# Altium schematic sheet ADC-DAC Converter.SchDoc: STM32 ADC-DAC Converter
size A4; Author: Atakana; Engineer: Atakan Ağcakaya; Revision: V1; SheetNumber: 1; SheetTotal: 1
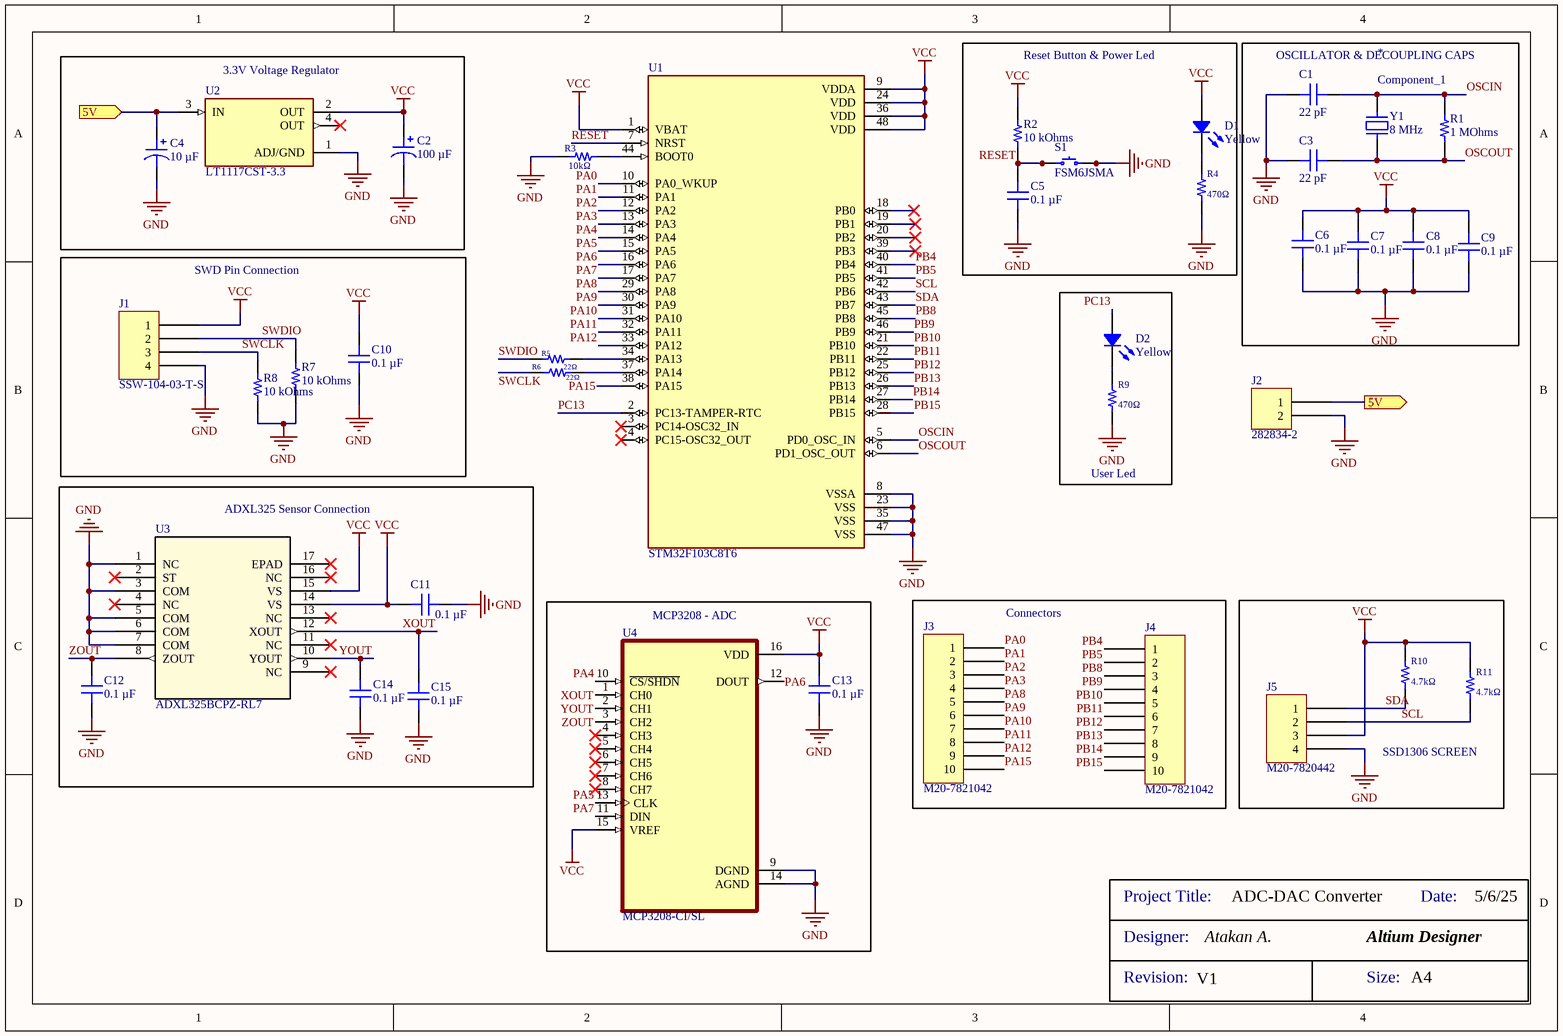
[diagram p0: ADC-DAC Converter.SchDoc]

## Parts
(Parts that share a designator on the sheet are numbered #1, #2 ... from top to bottom, then left to right.)
*#1  Component_1
*#2  DateProject: 5/6/25  ProjectTitle: ADC-DAC Converter  RevisionProject: V1  Size: A4  Designer: Atakan A.  (hidden comment: Title Block)  (graphical)
C1  22 pF  [CAP 0805_2012]
C2  value 100 µF  [CAP POL 1411_3528]  (hidden comment: 100uF)
C3  22 pF  [CAP 0805_2012]
C4  10 µF  [CAP POL 1411_3528]
C5  0.1 µF  [CAP 1206_3216 - 0.8MM]
C6  0.1 µF  [CAP 1206_3216 - 0.8MM]
C7  0.1 µF  [CAP 1206_3216 - 0.8MM]
C8  0.1 µF  [CAP 1206_3216 - 0.8MM]
C9  0.1 µF  [CAP 1206_3216 - 0.8MM]
C10  0.1 µF  [CAP 1206_3216 - 0.8MM]
C11  0.1 µF  [CAP 0805_2012]
C12  0.1 µF  [CAP 0805_2012]
C13  0.1 µF  [CAP 0805_2012]
C14  0.1 µF  [CAP 0805_2012]
C15  0.1 µF  [CAP 0805_2012]
D1  Yellow  [LED 1206_3216 YELLOW]
D2  Yellow  [LED 1206_3216 YELLOW]
J1  SSW-104-03-T-S  [SAMTEC SSW-104-03-T-S]
J2  282834-2  [TE 282834-2]
J3  M20-7821042  [HARWIN M20-7821045]
J4  M20-7821042  [HARWIN M20-7821045]
J5  M20-7820442  [HARWIN M20-7820445]
R1  1 MOhms  [RES 0805_2012]
R2  10 kOhms  [RES 1206_3216]
R3  10kΩ  [RES 0805_2012]
R4  470Ω  [RES 0805_2012]
R5  22Ω  [RES 0805_2012]
R6  22Ω  [RES 0805_2012]
R7  10 kOhms  [RES 1206_3216]
R8  10 kOhms  [RES 1206_3216]
R9  470Ω  [RES 0805_2012]
R10  4.7kΩ  [RES 0805_2012]
R11  4.7kΩ  [RES 0805_2012]
S1  FSM6JSMA  [TE FSM6JSMA]
U1  STM32F103C8T6  [QFP50P900X900X160-48N]
U2  LT1117CST-3.3  [REG_LT1117CST-3.3]
U3  ADXL325BCPZ-RL7  [CP_16_5A_ADI-M]
U4  MCP3208-CI/SL  [SOIC127P600X175-16N]
Y1  8 MHz  [ABRACON ABLS]

## Blocks framed on the sheet
3.3V Voltage Regulator: C2 C4 U2
Reset Button & Power Led: C5 D1 R2 R4 S1
OSCILLATOR & DECOUPLING CAPS: *#1 C1 C3 C6-C9 R1 Y1
SWD Pin Connection: C10 J1 R7 R8
User Led: D2 R9
ADXL325 Sensor Connection: C11 C12 C14 C15 U3
MCP3208 - ADC: C13 U4
Connectors: J3 J4
SSD1306 SCREEN: J5 R10 R11

## Ports
5V (in), 5V (out)

## Nets
GND: C1.1 C2.2 C3.1 C4.2 C5.1 C6.1 C7.1 C8.1 C9.1 C10.1 C11.1 C12.1 C13.1 C14.1 C15.1 J1.4 J2.2 J5.4 R3.1 R4.2 R7.1 R8.1 R9.2 S1.3 S1.4 U1.8(VSSA) U1.23(VSS) U1.35(VSS) U1.47(VSS) U2.1(ADJ/GND) U3.1(NC) U3.3(COM) U3.5(COM) U3.6(COM) U3.7(COM) U4.9(DGND) U4.14(AGND)
VCC: C2.1 C6.2 C7.2 C8.2 C9.2 C10.2 C11.2 C13.2 D1.1 J1.1 J5.3 R2.2 R10.1 R11.1 U1.1(VBAT) U1.9(VDDA) U1.24(VDD) U1.36(VDD) U1.48(VDD) U2.2(OUT) U3.14(VS) U3.15(VS) U4.15(VREF) U4.16(VDD)
5V: C4.1 J2.1 U2.3(IN) ; port 5V
OSCIN: C1.2 R1.2 U1.5(PD0_OSC_IN) Y1.2
OSCOUT: C3.2 R1.1 U1.6(PD1_OSC_OUT) Y1.1
PA0: J3.1 U1.10(PA0_WKUP)
PA1: J3.2 U1.11(PA1)
PA2: J3.3 U1.12(PA2)
PA3: J3.4 U1.13(PA3)
PA4: U1.14(PA4) U4.10(~{CS/SHDN})
PA5: U1.15(PA5) U4.13(CLK)
PA6: U1.16(PA6) U4.12(DOUT)
PA7: U1.17(PA7) U4.11(DIN)
PA8: J3.5 U1.29(PA8)
PA9: J3.6 U1.30(PA9)
PA10: J3.7 U1.31(PA10)
PA11: J3.8 U1.32(PA11)
PA12: J3.9 U1.33(PA12)
PA15: J3.10 U1.38(PA15)
PB4: J4.1 U1.40(PB4)
PB5: J4.2 U1.41(PB5)
PB8: J4.3 U1.45(PB8)
PB9: J4.4 U1.46(PB9)
PB10: J4.5 U1.21(PB10)
PB11: J4.6 U1.22(PB11)
PB12: J4.7 U1.25(PB12)
PB13: J4.8 U1.26(PB13)
PB14: J4.9 U1.27(PB14)
PB15: J4.10 U1.28(PB15)
PC13: D2.1 U1.2(PC13-TAMPER-RTC)
RESET: C5.2 R2.1 S1.1 S1.2 U1.7(NRST)
SCL: J5.2 R11.2 U1.42(PB6)
SDA: J5.1 R10.2 U1.43(PB7)
SWCLK: J1.3 R6.2 R8.2
SWDIO: J1.2 R5.2 R7.2
XOUT: C15.2 U3.12(XOUT) U4.1(CH0)
YOUT: C14.2 U3.10(YOUT) U4.2(CH1)
ZOUT: C12.2 U3.8(ZOUT) U4.3(CH2)
NetD1_2: D1.2 R4.1
NetD2_2: D2.2 R9.1
NetR3_2: R3.2 U1.44(BOOT0)
NetR5_1: R5.1 U1.34(PA13)
NetR6_1: R6.1 U1.37(PA14)

Not connected (* = marked no-connect by the designer): U1 3(PC14-OSC32_IN)* 4(PC15-OSC32_OUT)* 18(PB0)* 19(PB1)* 20(PB2)* 39(PB3)*; U2 4(OUT)*; U3 2(ST)* 4(NC)* 9(NC)* 11(NC)* 13(NC)* 16(NC)* 17(EPAD)*; U4 4(CH3)* 5(CH4)* 6(CH5)* 7(CH6)* 8(CH7)*

## Notes on the sheet
- Title
- Size:
- Date:
- A4
- Number:
- Time:
- Revision:
- Sheet
- of
- File:
- (in symbol Title Block) Project Title:; Date:; Designer:; Altium Designer; Revision:; Size:

## Library data of the parts
C1 C3 = 885012007030: CAP CER 22PF 25V C0G/NP0 0805; manufacturer: Würth Elektronik; Temperature Coefficient: C0G, NP0; Tolerance: ±5%; Part Number: 885012007030; Applications: General Purpose; componentlink1description: Datasheet; componentlink1url: https://katalog.we-online.de/pbs/datasheet/885012007030.pdf; componentlink2description: DigiKey Link; componentlink2url: https://www.digikey.com/en/products/detail/würth-elektronik/885012007030/5453684; Device Package: 0805 (2012 Metric); lastupdated: 9.02.2024 20:15:45; Lifecycle Status: Active; Minimum Order: 1; Mounting Type: Surface Mount, MLCC; Operating Temperature: -55°C ~ 125°C; Package / Case: 0805 (2012 Metric); packaging: TapeAndReel; partid: 11788; Part Status: Active; price: 0.03; series: WCAP-CSGP; Size / Dimension: 0.079" L x 0.049" W (2.00mm x 1.25mm); Supplier 1: DigiKey; Supplier Part Number 1: 732-7829-1-ND; Thickness (Max): 0.028" (0.70mm); value: 22 pF; Voltage - Rated: 25V
  C1: Capacitance: 22 pF
C2 = T491T106K016AT: CAP TANT 100UF 10% 16V 1411; manufacturer: KEMET; Manufacturer Size Code: T; ESR (Equivalent Series Resistance): 8Ohm; Lifetime @ Temp.: 2000 Hrs @ 125°C; Type: Molded; Part Number: T491T106K016AT; Capacitance: 100 uF; componentlink1description: Datasheet; componentlink1url: https://api.kemet.com/component-edge/download/datasheet/T491T106K016AT.pdf; componentlink2description: DigiKey Link; componentlink2url: https://www.digikey.com/en/products/detail/kemet/T491T106K016AT/2336362; Device Package: 1411 (3528 Metric); Features: General Purpose; Height - Seated (Max): 0.047" (1.20mm); lastupdated: 3.06.2024 19:29:03; Lifecycle Status: Active; Minimum Order: 1; Mounting Type: Surface Mount; Operating Temperature: -55°C ~ 125°C; Package / Case: 1411 (3528 Metric); packaging: TapeAndReel; partid: 5; Part Status: Active; price: 0.42; series: T491; Size / Dimension: 0.138" L x 0.110" W (3.50mm x 2.80mm); Supplier 1: DigiKey; Supplier Part Number 1: 399-8400-1-ND; Tolerance: ±10%; Voltage - Rated: 16 V
C4 = T491T106K016AT: CAP TANT 10UF 10% 16V 1411; manufacturer: KEMET; Manufacturer Size Code: T; ESR (Equivalent Series Resistance): 8Ohm; Lifetime @ Temp.: 2000 Hrs @ 125°C; Type: Molded; Part Number: T491T106K016AT; Value: 10 µF; Capacitance: 10 µF; componentlink1description: Datasheet; componentlink1url: https://api.kemet.com/component-edge/download/datasheet/T491T106K016AT.pdf; componentlink2description: DigiKey Link; componentlink2url: https://www.digikey.com/en/products/detail/kemet/T491T106K016AT/2336362; Device Package: 1411 (3528 Metric); Features: General Purpose; Height - Seated (Max): 0.047" (1.20mm); lastupdated: 3.06.2024 19:29:03; Lifecycle Status: Active; Minimum Order: 1; Mounting Type: Surface Mount; Operating Temperature: -55°C ~ 125°C; Package / Case: 1411 (3528 Metric); packaging: TapeAndReel; partid: 5; Part Status: Active; price: 0.42; series: T491; Size / Dimension: 0.138" L x 0.110" W (3.50mm x 2.80mm); Supplier 1: DigiKey; Supplier Part Number 1: 399-8400-1-ND; Tolerance: ±10%; Voltage - Rated: 16 V
C5-C10 = C1206C104K8RAC7800: CAP CER 0.1UF 10V X7R 1206; manufacturer: KEMET; Tolerance: ±10%; Part Number: C1206C104K8RAC7800; Applications: Bypass, Decoupling; componentlink1description: Datasheet; componentlink1url: https://api.kemet.com/component-edge/download/datasheet/C1206C104K8RACTU.pdf; componentlink2description: DigiKey Link; componentlink2url: https://www.digikey.com/en/products/detail/kemet/C1206C104K8RAC7800/2215080; Device Package: 1206 (3216 Metric); lastupdated: 4.06.2024 19:10:37; Lifecycle Status: Active; Minimum Order: 1; Mounting Type: Surface Mount, MLCC; Operating Temperature: -55°C ~ 125°C; Package / Case: 1206 (3216 Metric); packaging: TapeAndReel; partid: 19429; Part Status: Active; price: 0.07; series: SMD Comm X7R; Size / Dimension: 0.126" L x 0.063" W (3.20mm x 1.60mm); Supplier 1: DigiKey; Supplier Part Number 1: 399-15539-1-ND; Temperature Coefficient: X7R; Thickness (Max): 0.035" (0.88mm); value: 0.1 µF; Voltage - Rated: 10V
C11-C15 = 0805Y0250104KXT: CAP CER 0.1UF 25V X7R 0805; manufacturer: Knowles Syfer; Tolerance: ±10%; Part Number: 0805Y0250104KXT; Capacitance: 0.1 µF; Applications: Boardflex Sensitive; componentlink1description: Datasheet; componentlink1url: https://www.knowlescapacitors.com/getattachment/2dbfc8bc-e2b3-4b4d-afb1-43b011b9ebe0/High-Std-Voltage.aspx; componentlink2description: DigiKey Link; componentlink2url: https://www.digikey.com/en/products/detail/knowles-syfer/0805Y0250104KXT/5729991; Device Package: 0805 (2012 Metric); Features: Soft Termination; lastupdated: 9.02.2024 20:16:06; Lifecycle Status: Active; Minimum Order: 1; Mounting Type: Surface Mount, MLCC; Operating Temperature: -55°C ~ 125°C; Package / Case: 0805 (2012 Metric); packaging: TapeAndReel; partid: 3471; Part Status: Active; price: 0.15; series: FlexiCap™; Size / Dimension: 0.079" L x 0.049" W (2.00mm x 1.25mm); Supplier 1: DigiKey; Supplier Part Number 1: 1608-1010-1-ND; Temperature Coefficient: X7R; Thickness (Max): 0.051" (1.30mm); value: 0.1 µF; Voltage - Rated: 25V
D1 D2 = 5990240007F: LED YELLOW 1206 SMD; Manufacturer: Dialight; Configuration: Standard; Current - Test: 20mA; Lens Color: 0.80mm; Lens Size: 2.00mm x 1.60mm; Lens Style: Rectangle with Flat Top; Millicandela Rating: 126mcd; Viewing Angle: 140°; Voltage - Forward (Vf) (Typ): 2.1V; Wavelength - Dominant: 590nm; Part Number: 5990240007F; Color: Yellow; ComponentLink1Description: Datasheet; ComponentLink1URL: http://www.dialightsignalsandcomponents.com/Assets/Brochures_And_Catalogs/Indication/CBI_SMD_new/Dialight_CBI_data_599-1206_Apr2018.pdf; ComponentLink2Description: DigiKey Link; ComponentLink2URL: https://www.digikey.com/en/products/detail/dialight/5990240007F/9385418; Device Package: 1206 (3216 Metric); Height (Max): 0.80mm; LastUpdated: 3.06.2024 20:01:38; Lifecycle Status: Active; Minimum Order: 1; Mounting Type: Surface Mount; Package / Case: 1206 (3216 Metric); Packaging: TapeAndReel; PartId: 1; Part Status: Active; Price: 0.04; Series: 599; Size / Dimension: 3.20mm L x 1.60mm W; Supplier 1: DigiKey; Supplier Part Number 1: 350-4363-1-ND; Supplier Device Package: 1206; Value: Yellow
J1 = SSW-104-03-T-S: CONN RCPT 4POS 0.1 TIN PCB; Manufacturer: Samtec Inc.; Connector Type: Receptacle; Current Rating (Amps): 5.7A per Contact; Material Flammability Rating: UL94 V-0; Number of Positions: 4; Number of Positions Loaded: All; Style: Board to Board or Cable; Part Number: SSW-104-03-T-S; ComponentLink2Description: DigiKey Link; ComponentLink2URL: http://digikey.com/product-detail/en/samtec-inc/SSW-104-03-T-S/SSW-104-03-T-S-ND/7874034; Contact Finish - Mating: Tin; Contact Finish - Post: Tin; Contact Type: Forked; Fastening Type: Push-Pull; Insulation Color: Black; LastUpdated: 21.06.2022 15:08:52; Lifecycle Status: Active; Minimum Order: 1; Mounting Type: Through Hole; Number of Rows: 1; Operating Temperature: -55°C ~ 105°C; Packaging: Bulk; Part Status: Active; Price: 0.83; Series: SSW; Supplier 1: DigiKey; Supplier Part Number 1: SSW-104-03-T-S-ND; Termination: Solder
J2 = 282834-2: TERM BLK 2P SIDE ENT 2.54MM PCB; Manufacturer: TE Connectivity AMP Connectors; Current: 10A; Mating Orientation: Horizontal with Board; Number of Levels: 1; Pitch: 0.100" (2.54mm); Positions Per Level: 2; Voltage: 150V; Wire Gauge: 16-30 AWG; Wire Termination: Screw - Rising Cage Clamp; Part Number: 282834-2; Color: Green; ComponentLink1Description: Datasheet; ComponentLink1URL: https://www.te.com/commerce/DocumentDelivery/DDEController?Action=srchrtrv&DocNm=282834&DocType=Customer+Drawing&DocLang=English; ComponentLink2Description: DigiKey Link; ComponentLink2URL: http://digikey.com/product-detail/en/te-connectivity-amp-connectors/282834-2/A98333-ND/1150135; LastUpdated: 15.01.2020 04:15:38; Lifecycle Status: Active; Minimum Order: 1; Mounting Type: Through Hole; Packaging: Bulk; Part Status: Active; Price: 0.88; Series: Buchanan; Supplier 1: DigiKey; Supplier Part Number 1: A98333-ND
J3 J4 = M20-7821042: CONN RCPT 10POS 0.1 GOLD PCB; Manufacturer: Harwin Inc.; Connector Type: Receptacle; Contact Length - Post: 0.118" (3.00mm); Current Rating (Amps): 3A; Mated Stacking Heights: 11.04mm, 12.63mm; Material Flammability Rating: UL94 V-0; Number of Positions: 10; Number of Positions Loaded: All; Pitch - Mating: 0.100" (2.54mm); Style: Board to Board or Cable; Part Number: M20-7821042; ComponentLink1Description: Datasheet; ComponentLink1URL: https://cdn.harwin.com/pdfs/Harwin_PC_Connectors_M20.pdf; ComponentLink2Description: DigiKey Link; ComponentLink2URL: http://digikey.com/product-detail/en/harwin-inc/M20-7821042/952-1846-ND/3727813; Contact Finish - Mating: Gold; Contact Finish - Post: Tin; Contact Finish Thickness - Mating: Flash; Contact Type: Female Socket; Fastening Type: Push-Pull; Insulation Color: Black; Insulation Height: 0.335" (8.51mm); LastUpdated: 21.09.2022 18:59:03; Lifecycle Status: Active; Minimum Order: 1; Mounting Type: Through Hole; Number of Rows: 1; Operating Temperature: -40°C ~ 105°C; Packaging: Tube; Part Status: Active; Price: 1.39; Series: M20; Supplier 1: DigiKey; Supplier Part Number 1: 952-1846-ND; Termination: Solder
J5 = M20-7820442: CONN RCPT 4POS 0.1 GOLD PCB; Manufacturer: Harwin Inc.; Connector Type: Receptacle; Contact Length - Post: 0.118" (3.00mm); Current Rating (Amps): 3A; Mated Stacking Heights: 11.04mm, 12.63mm; Material Flammability Rating: UL94 V-0; Number of Positions: 4; Number of Positions Loaded: All; Pitch - Mating: 0.100" (2.54mm); Style: Board to Board or Cable; Part Number: M20-7820442; ComponentLink1Description: Datasheet; ComponentLink1URL: https://cdn.harwin.com/pdfs/Harwin_PC_Connectors_M20.pdf; ComponentLink2Description: DigiKey Link; ComponentLink2URL: https://www.digikey.com/en/products/detail/harwin-inc/M20-7820442/3727760; Contact Finish - Mating: Gold; Contact Finish - Post: Tin; Contact Finish Thickness - Mating: Flash; Contact Type: Female Socket; Fastening Type: Push-Pull; Insulation Color: Black; Insulation Height: 0.335" (8.51mm); LastUpdated: 21.09.2022 18:57:11; Lifecycle Status: Active; Minimum Order: 1; Mounting Type: Through Hole; Number of Rows: 1; Operating Temperature: -40°C ~ 105°C; Packaging: Tube; Part Status: Active; Price: 0.45; Series: M20; Supplier 1: DigiKey; Supplier Part Number 1: 952-1791-ND; Termination: Solder
R1 = RCS08051M00FKEA: RES SMD 1M OHM 1% 1/2W 0805; Manufacturer: Vishay Dale; Power (Watts): 0.5W, 1/2W; Temperature Coefficient: ±100ppm/°C; Part Number: RCS08051M00FKEA; Value: 1 MOhms; ComponentLink1Description: Datasheet; ComponentLink1URL: http://www.vishay.com/docs/20065/rcse3.pdf; ComponentLink2Description: DigiKey Link; ComponentLink2URL: https://www.digikey.com/en/products/detail/vishay-dale/RCS08051M00FKEA/5866999; Composition: Thick Film; Device Package: 0805 (2012 Metric); Features: Automotive AEC-Q200, Pulse Withstanding; Height - Seated (Max): 0.020" (0.50mm); LastUpdated: 8.02.2024 21:02:38; Lifecycle Status: Active; Minimum Order: 1; Number of Terminations: 2; Operating Temperature: -55°C ~ 155°C; Package / Case: 0805 (2012 Metric); Packaging: TapeAndReel; PartId: 27791; Part Status: Active; Price: 0.02; Ratings: AEC-Q200; Resistance: 1 MOhms; Series: RCS e3; Size / Dimension: 0.079" L x 0.049" W (2.00mm x 1.25mm); Supplier 1: DigiKey; Supplier Part Number 1: 541-2853-1-ND; Supplier Device Package: 0805; Tolerance: ±1%
R2 R7 R8 = ESR18EZPF1002: RES SMD 10K OHM 1% 1/2W 1206; Manufacturer: Rohm Semiconductor; Power (Watts): 0.5W, 1/2W; Temperature Coefficient: ±100ppm/°C; Part Number: ESR18EZPF1002; ComponentLink1Description: Datasheet; ComponentLink1URL: https://www.rohm.com/datasheet/ESR01MZPF/esr-e; ComponentLink2Description: DigiKey Link; ComponentLink2URL: https://www.digikey.com/en/products/detail/rohm-semiconductor/ESR18EZPF1002/1983592; Composition: Thick Film; Device Package: 1206 (3216 Metric); Features: Automotive AEC-Q200, Pulse Withstanding; Height - Seated (Max): 0.026" (0.65mm); LastUpdated: 9.02.2024 20:54:45; Lifecycle Status: Active; Minimum Order: 1; Number of Terminations: 2; Operating Temperature: -55°C ~ 155°C; Package / Case: 1206 (3216 Metric); Packaging: TapeAndReel; PartId: 26965; Part Status: Active; Price: 0.02; Ratings: AEC-Q200; Resistance: 10 kOhms; Series: ESR; Size / Dimension: 0.126" L x 0.063" W (3.20mm x 1.60mm); Supplier 1: DigiKey; Supplier Part Number 1: RHM10.0KAFCT-ND; Supplier Device Package: 1206; Tolerance: ±1%; Value: 10 kOhms
R3-R6 R9-R11 = CPF0805B22RE1: RES SMD 22 OHM 0.1% 1/10W 0805; Manufacturer: TE Connectivity Passive Product; Power (Watts): 0.1W, 1/10W; Resistance: 22 Ohms; Temperature Coefficient: ±25ppm/°C; Part Number: CPF0805B22RE1; ComponentLink1Description: Datasheet; ComponentLink1URL: https://www.te.com/commerce/DocumentDelivery/DDEController?Action=srchrtrv&DocNm=1773200&DocType=DS&DocLang=English; ComponentLink2Description: DigiKey Link; ComponentLink2URL: https://www.digikey.com/en/products/detail/te-connectivity-passive-product/CPF0805B22RE1/2381993; Composition: Thin Film; Device Package: 0805 (2012 Metric); Height - Seated (Max): 0.026" (0.65mm); LastUpdated: 8.02.2024 21:02:36; Lifecycle Status: Active; Minimum Order: 1; Number of Terminations: 2; Operating Temperature: -55°C ~ 155°C; Package / Case: 0805 (2012 Metric); Packaging: TapeAndReel; PartId: 28451; Part Status: Active; Price: 0.12; Series: CPF, Neohm; Size / Dimension: 0.079" L x 0.049" W (2.00mm x 1.25mm); Supplier 1: DigiKey; Supplier Part Number 1: A103179CT-ND; Supplier Device Package: 0805; Tolerance: ±0.1%
  R3: Value: 10kΩ
  R4 R9: Value: 470Ω
  R5 R6: Value: 22Ω
  R10 R11: Value: 4.7kΩ
S1 = FSM6JSMA: SWITCH TACTILE SPST-NO 0.05A 24V; Manufacturer: TE Connectivity ALCOSWITCH Switches; Actuator Height off PCB, Vertical: 7.00mm; Actuator Orientation: Top Actuated; Actuator Type: Standard; Contact Rating @ Voltage: 0.05A @ 24VDC; Illumination: Non-Illuminated; Operating Force: 160gf; Outline: 6.00mm x 6.00mm; Switch Function: Off-Mom; Part Number: FSM6JSMA; Circuit: SPST-NO; ComponentLink1Description: Datasheet; ComponentLink1URL: https://www.te.com/commerce/DocumentDelivery/DDEController?Action=srchrtrv&DocNm=1308111-1_SWITCHES_CORE_PROGRAM_CATALOG&DocType=CS&DocLang=English; ComponentLink2Description: DigiKey Link; ComponentLink2URL: https://www.digikey.com/en/products/detail/te-connectivity-alcoswitch-switches/FSM6JSMA/525822; LastUpdated: 3.06.2024 20:19:31; Lifecycle Status: Active; Minimum Order: 1; Mounting Type: Surface Mount; Operating Temperature: -35°C ~ 85°C; Packaging: Bulk; Part Status: Active; Price: 0.17; Series: FSMJSMA; Supplier 1: DigiKey; Supplier Part Number 1: 450-1133-ND; Termination Style: Gull Wing
U1 = STM32F103C8T6: ARM® Cortex®-M3 STM32F1 Microcontroller IC 32-Bit 72MHz 64KB (64K x 8) FLASH 48-LQFP (7x7); MF: STMicroelectronics; SnapEDA_Link: https://www.snapeda.com/parts/STM32F103C8T6/STMicroelectronics/view-part/?ref=snap; Package: LQFP-48 STMicroelectronics; Value: *; MP: STM32F103C8T6; Check_prices: https://www.snapeda.com/parts/STM32F103C8T6/STMicroelectronics/view-part/?ref=eda
U2 = LT1117CST-3.3: Linear Voltage Regulator IC Positive Fixed 1 Output 800mA SOT-223-3; MF: Analog Devices / Linear Technology; SnapEDA_Link: https://www.snapeda.com/parts/LT1117CST-3.3/Analog+Devices/view-part/?ref=snap; Package: SOT-223-3 Analog Devices; Value: *; MP: LT1117CST-3.3; Check_prices: https://www.snapeda.com/parts/LT1117CST-3.3/Analog+Devices/view-part/?ref=eda
U3 = ADXL325BCPZ-RL7: No Description Available; Mfr_Name: Analog Devices Inc; RefDes: RefDes; Type: Type
U4 = MCP3208-CI/SL: Microchip 12 bit Serial ADC Differential Input 16-Pin SOIC | Microchip Technology Inc. MCP3208-CI/SL; SnapEDA_Link: https://www.snapeda.com/parts/MCP3208-CI/SL/Microchip/view-part/?ref=snap; Package: SOIC-16 Microchip; Value: *; MF: Microchip Technology; MP: MCP3208-CI/SL; Check_prices: https://www.snapeda.com/parts/MCP3208-CI/SL/Microchip/view-part/?ref=eda
Y1 = ABLS-8.000MHZ-16-A-4-H-T: CRYSTAL 8.0000MHZ 16PF SMD; Manufacturer: Abracon LLC; ESR (Equivalent Series Resistance): 80 Ohms; Frequency Stability: ±35ppm; Frequency Tolerance: ±30ppm; Operating Mode: Fundamental; Part Number: ABLS-8.000MHZ-16-A-4-H-T; ComponentLink1Description: Datasheet; ComponentLink1URL: https://abracon.com/Resonators/abls.pdf; ComponentLink2Description: DigiKey Link; ComponentLink2URL: https://www.digikey.com/en/products/detail/abracon-llc/ABLS-8-000MHZ-16-A-4-H-T/9997850; Frequency: 8 MHz; Height - Seated (Max): 0.165" (4.20mm); LastUpdated: 3.06.2024 20:02:02; Lifecycle Status: Active; Load Capacitance: 16pF; Minimum Order: 1; Mounting Type: Surface Mount; Operating Temperature: -10°C ~ 60°C; Package / Case: HC-49/US; Packaging: TapeAndReel; PartId: 58; Part Status: Active; Price: 0.10; Series: ABLS; Size / Dimension: 0.449" L x 0.185" W (11.40mm x 4.70mm); Supplier 1: DigiKey; Supplier Part Number 1: 535-14942-1-ND; Type: MHz Crystal; Value: 8 MHz